# Altium schematic sheet DAC_Magneto.SchDoc: DAC
size 420 x 297 mm; Author: G.Kasprowicz; CompanyName: WUT ISE; DrawnBy: G.Kasprowicz; Organization: WUT ISE; Address1: PW ISE; Address2: Nowowiejska 15/19 00-665 Warsaw; Address3: gkasprow@gmail.com; DocumentNumber: 6; Revision: 2; SheetNumber: 6; SheetTotal: 7; ModifiedBy: -; CheckedDate: -; Title2: & reference; DivGrp: WUT ISE; Designer: G.Kasprowicz; ModifiedDate: -; ProjectName: Sensor Box
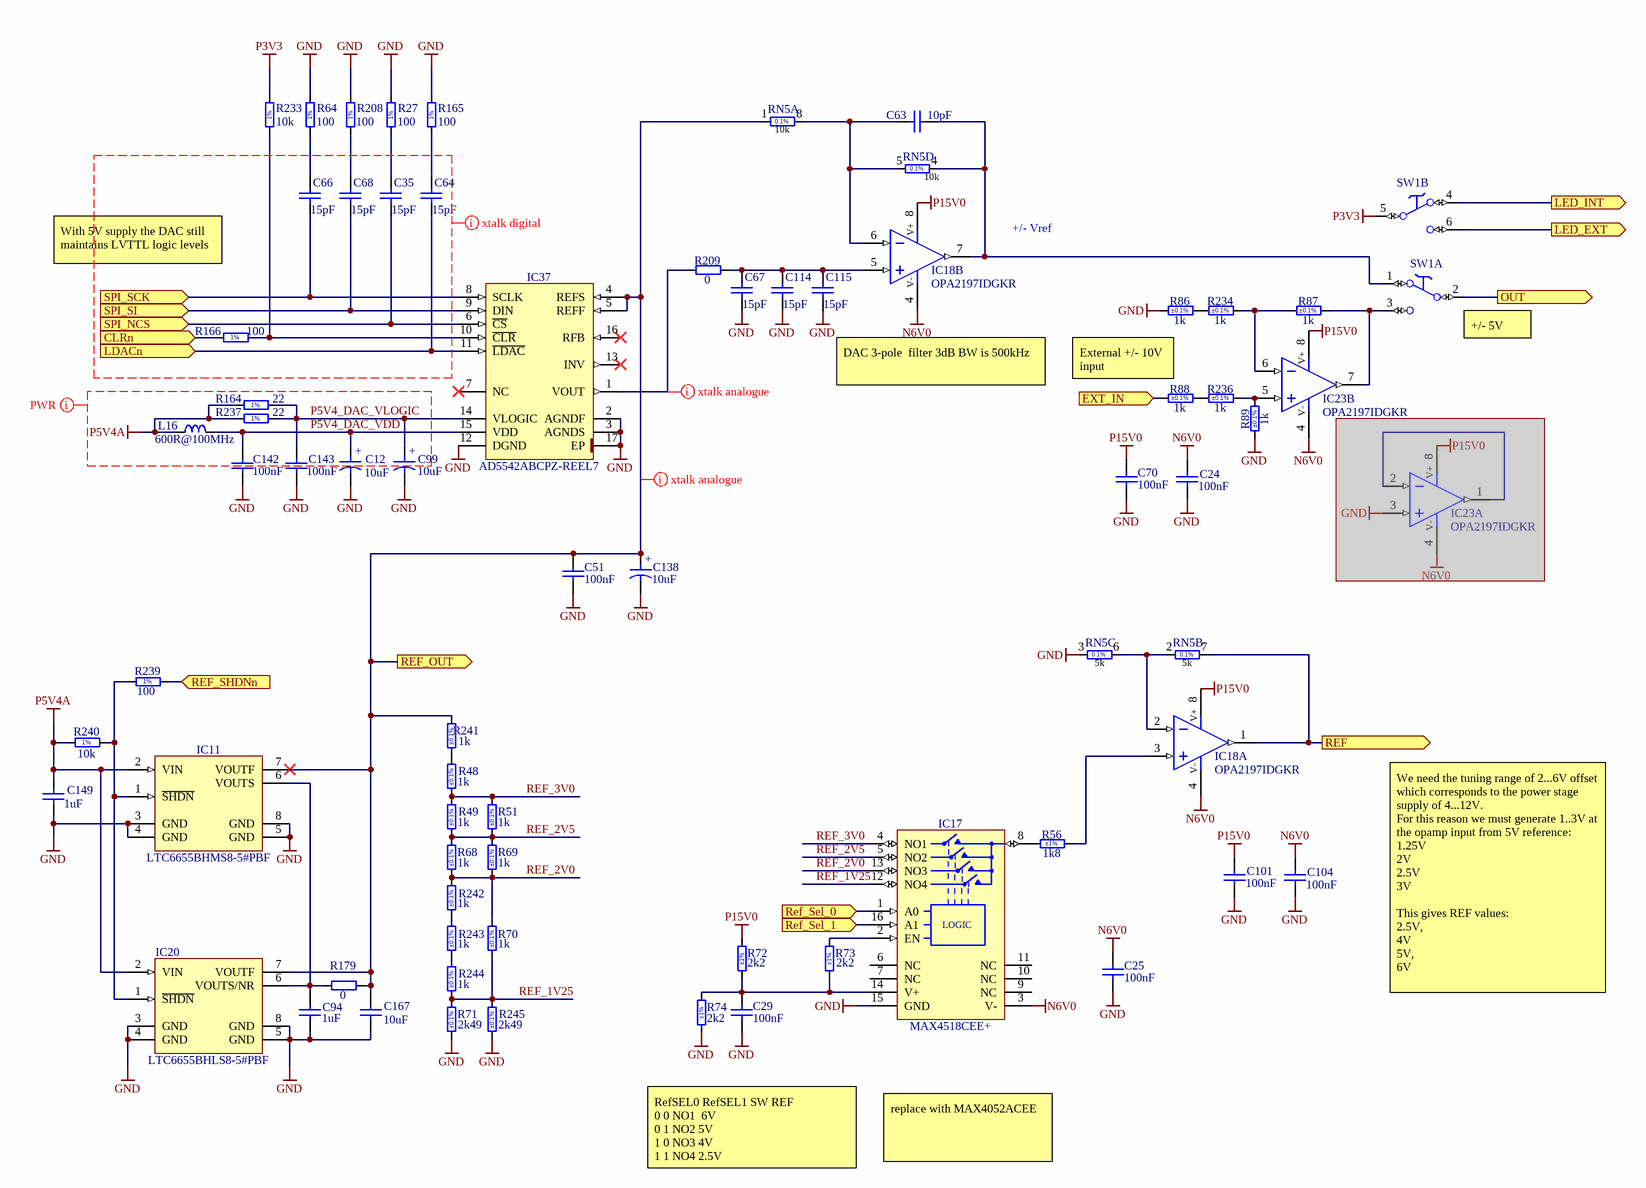
[diagram p0: DAC_Magneto.SchDoc]

## Parts
C12  10uF  [CAPMP3216X180N]
C24  100nF  [CAPC1005X55N]
C25  100nF  [CAPC1005X55N]
C29  100nF  [CAPC1005X55N]
C35  15pF  [CAPC1608X87N]
C51  100nF  [CAPC1005X55N]
C63  10pF  [CAPC1005X55N]
C64  15pF  [CAPC1608X87N]
C66  15pF  [CAPC1608X87N]
C67  15pF  [CAPC1608X87N]
C68  15pF  [CAPC1608X87N]
C70  100nF  [CAPC1005X55N]
C94  1uF  [CAPC1608X87N]
C99  10uF  [CAPMP3216X180N]
C101  100nF  [CAPC1005X55N]
C104  100nF  [CAPC1005X55N]
C114  15pF  [CAPC1608X87N]
C115  15pF  [CAPC1608X87N]
C138  10uF  [CAPMP3216X180N]
C142  100nF  [CAPC1005X55N]
C143  100nF  [CAPC1005X55N]
C149  1uF  [CAPC1608X87N]
C167  10uF  [CAPC1608X80N]
IC11  LTC6655BHMS8-5#PBF  [SOP65P490X110-8N]
IC17  MAX4518CEE+  [SOP63P600X175-16N]
IC18  OPA2197IDGKR  [SOP65P490X110-8N]  (parts A,B of 2)
IC20  LTC6655BHLS8-5#PBF  [8-CLCC]
IC23  OPA2197IDGKR  [SOP65P490X110-8N]  (parts A,B of 2)  (masked out: inside a compile mask, not in the netlist)
IC37  AD5542ABCPZ-REEL7  [QFN50P300X300X80-17N-S175]
L16  600R@100MHz  [INDC1005X55N]
R27  100  [RESC1005X40N]
R48  1k  Tolerance: ±0.1%  [RESC1608X55N]
R49  1k  Tolerance: ±0.1%  [RESC1608X55N]
R51  1k  Tolerance: ±0.1%  [RESC1608X55N]
R56  1k8  Tolerance: ±1%  [RESC1005X40N]
R64  100  [RESC1005X40N]
R68  1k  Tolerance: ±0.1%  [RESC1608X55N]
R69  1k  Tolerance: ±0.1%  [RESC1608X55N]
R70  1k  Tolerance: ±0.1%  [RESC1608X55N]
R71  2k49  Tolerance: ±0.1%  [RESC1608X55N]
R72  2k2  Tolerance: ±1%  [RESC1608X55N]
R73  2k2  Tolerance: ±1%  [RESC1608X55N]
R74  2k2  Tolerance: ±1%  [RESC1608X55N]
R86  1k  Tolerance: ±0.1%  [RESC1608X55N]
R87  1k  Tolerance: ±0.1%  [RESC1608X55N]
R88  1k  Tolerance: ±0.1%  [RESC1608X55N]
R89  1k  Tolerance: ±0.1%  [RESC1608X55N]
R164  22  [RESC1005X40N]
R165  100  [RESC1005X40N]
R166  100  [RESC1005X40N]
R179  0  [RESC1005X40N]
R208  100  [RESC1005X40N]
R209  0  [RESC1005X40N]
R233  10k  [RESC1005X40N]
R234  1k  Tolerance: ±0.1%  [RESC1608X55N]
R236  1k  Tolerance: ±0.1%  [RESC1608X55N]
R237  22  [RESC1005X40N]
R239  100  [RESC1005X40N]
R240  10k  [RESC1005X40N]
R241  1k  Tolerance: ±0.1%  [RESC1608X55N]
R242  1k  Tolerance: ±0.1%  [RESC1608X55N]
R243  1k  Tolerance: ±0.1%  [RESC1608X55N]
R244  1k  Tolerance: ±0.1%  [RESC1608X55N]
R245  2k49  Tolerance: ±0.1%  [RESC1608X55N]
RN5  10k 5K 5K 10K  [SOIC127P600X175-8N]  (value not drawn)  (parts A,B,C,D of 4)
SW1  Switch  [SW_C&K_JS202011CQN]  (value not drawn)  (parts A,B of 2)

## Ports
CLRn (in), EXT_IN (in), LDACn (in), LED_EXT (out), LED_INT (out), OUT (out), REF (out), REF_OUT (out), Ref_Sel_0 (in), Ref_Sel_1 (in), REF_SHDNn (in), SPI_NCS (in), SPI_SCK (in), SPI_SI (in)

## Nets
GND: C12.2 C24.1 C25.1 C29.1 C51.1 C67.1 C70.1 C94.1 C99.2 C101.1 C104.1 C114.1 C115.1 C138.2 C142.1 C143.1 C149.1 C167.1 IC11.3(GND) IC11.4(GND) IC11.5(GND) IC11.8(GND) IC17.15(GND) IC20.3(GND) IC20.4(GND) IC20.5(GND) IC20.8(GND) IC37.2(AGNDF) IC37.3(AGNDS) IC37.12(DGND) IC37.17(EP) R27.2 R64.2 R71.1 R74.1 R86.1 R89.1 R165.2 R208.2 R245.1 RN5.3
N6V0: C24.2 C25.2 C104.2 IC17.3(V-) IC18.4(V-) IC23.4(V-)
P3V3: R233.2 SW1.5(C)
P5V4A: C149.2 IC11.2(VIN) IC20.2(VIN) L16.1 R164.1 R237.1 R240.1
P15V0: C70.2 C101.2 IC18.8(V+) IC23.8(V+) R72.2
CLRn: R166.1 ; port CLRn
EXT_IN: R88.1 ; port EXT_IN
LDACn: C64.1 IC37.11(~{LDAC}) ; port LDACn
LED_EXT: SW1.6(NO) ; port LED_EXT
LED_INT: SW1.4(NC) ; port LED_INT
OUT: SW1.2(C) ; port OUT
P5V4_DAC_VDD: C12.1 C142.2 IC37.15(VDD) L16.2
P5V4_DAC_VLOGIC: C99.1 C143.2 IC37.14(VLOGIC) R164.2 R237.2
REF: IC18.1(OUT) RN5.7 ; port REF
REF_1V25: IC17.12(NO4) R70.1 R71.2 R244.1 R245.2
REF_2V0: IC17.13(NO3) R68.1 R69.1 R70.2 R242.2
REF_2V5: IC17.5(NO2) R49.1 R51.1 R68.2 R69.2
REF_3V0: IC17.4(NO1) R48.1 R49.2 R51.2
REF_OUT: C51.2 C138.1 C167.2 IC11.7(VOUTF) IC20.7(VOUTF) IC37.4(REFS) IC37.5(REFF) R179.2 R241.2 RN5.1 ; port REF_OUT
Ref_Sel_0: IC17.1(A0) ; port Ref_Sel_0
Ref_Sel_1: IC17.16(A1) ; port Ref_Sel_1
REF_SHDNn: R239.2 ; port REF_SHDNn
SPI_NCS: C35.1 IC37.6(~{CS}) ; port SPI_NCS
SPI_SCK: C66.1 IC37.8(SCLK) ; port SPI_SCK
SPI_SI: C68.1 IC37.9(DIN) ; port SPI_SI
NetC29_2: C29.2 IC17.14(V+) R72.1 R73.1 R74.2
NetC35_2: C35.2 R27.1
NetC63_1: C63.1 IC18.6(IN-) RN5.5 RN5.8
NetC63_2: C63.2 IC18.7(OUT) RN5.4 SW1.1(NC)
NetC64_2: C64.2 R165.1
NetC66_2: C66.2 R64.1
NetC67_2: C67.2 C114.2 C115.2 IC18.5(IN+) R209.2
NetC68_2: C68.2 R208.1
NetC94_2: C94.2 IC11.6(VOUTS) IC20.6(VOUTS/NR) R179.1
NetIC11_1: IC11.1(~{SHDN}) IC20.1(~{SHDN}) R239.1 R240.2
NetIC17_2: IC17.2(EN) R73.2
NetIC17_8: IC17.8(COM) R56.1
NetIC18_2: IC18.2(IN-) RN5.2 RN5.6
NetIC18_3: IC18.3(IN+) R56.2
NetIC23_5: IC23.5(IN+) R89.2 R236.2
NetIC23_6: IC23.6(IN-) R87.1 R234.2
NetIC23_7: IC23.7(OUT) R87.2 SW1.3(NO)
NetIC37_1: IC37.1(VOUT) R209.1
NetIC37_10: IC37.10(~{CLR}) R166.2 R233.1
NetR48_2: R48.2 R241.1
NetR86_2: R86.2 R234.1
NetR88_2: R88.2 R236.1
NetR242_1: R242.1 R243.2
NetR243_1: R243.1 R244.2

Not connected (* = marked no-connect by the designer): IC17 6(NC) 7(NC) 9(NC) 10(NC) 11(NC); IC37 7(NC)* 13(INV)* 16(RFB)*

## Layout directives
net class xtalk digital: (no net found under the mark)
net class xtalk analogue: NetIC37_1, REF_OUT
net class PWR: P5V4_DAC_VDD, P5V4_DAC_VLOGIC, P5V4A

## Notes on the sheet
- With 5V supply the DAC still maintains LVTTL logic levels
- +/- Vref
- (near SW1) +/- 5V
- DAC 3-pole  filter 3dB BW is 500kHz
- External +/- 10V input
- We need the tuning range of 2...6V offset
  which corresponds to the power stage supply of 4...12V.
  For this reason we must generate 1..3V at the opamp input from 5V reference:
  1.25V
  2V
  2.5V
  3V
  This gives REF values:
  2.5V,
  4V
  5V,
  6V
- RefSEL0	RefSEL1	SW	REF
  0	0	NO1 	6V
  0	1	NO2	5V
  1	0	NO3	4V
  1	1	NO4	2.5V
- replace with MAX4052ACEE
- Project/Equipment
- Document
- Designer
- Drawn by
- Check.by
- Copyright WUT ISE 2020.
  This documentation describes Open Hardware and is licensed under the CERN OHL v.1.2. You may redistribute and modify this documentation under the terms of the CERN OHL v.1.2. (http://ohwr.org/CERNOHL). This documentation is distributed WITHOUT ANY EXPRESS OR IMPLIED WARRANTY, INCLUDING OF MERCHANTABILITY, SATISFACTORY QUALITY AND FITNESS FOR A PARTICULAR PURPOSE. Please see the CERN OHL v.1.2 for applicable conditions.
- Contact
- File
- Last Mod.
- Print Date
- Sheet
- Size
- A3
- of
- Rev
- (in symbol CTE3216-18_10UF_16V_20%_AVX_TCJ) +
- (in symbol MAX4518CEE+) LOGIC
- (in symbol R0402_10K_1%_0.0625W_100PPM) 1%
- (in symbol R0402_22R_1%_0.0625W_100PPM) 1%
- (in symbol R0402_100R_1%_0.0625W_100PPM) 1%
- (in symbol RN_10K_5K_VISHAY_AORN2-1AT3, part A) 10k
- (in symbol RN_10K_5K_VISHAY_AORN2-1AT3, part B) 5k
- (in symbol RN_10K_5K_VISHAY_AORN2-1AT3, part C) 5k
- (in symbol RN_10K_5K_VISHAY_AORN2-1AT3, part D) 10k

## Library data of the parts
C12 C99 C138 = CTE3216-18_10UF_16V_20%_AVX_TCJ: Polarised capacitor; Part Description: ESR 0R200 Tantalum Solid Electrolytic Chip Capacitor with Conductive Polymer Electrode; Manufacturer: AVX; Manufacturer Part Number: TCJA106M016R0200 or  or TR3A106K016C1700; Manufacturer1 Part Number: TCJA106M016R0200; Voltage: 16V; Tolerance: ±20%; Part Number: CTE3216-18_10UF_16V_20%_AVX_TCJ; Component Kind: Standard; Component Type: Standard; Pin Count: 2; Value: 10uF; Status: Preferred; Case: A; Mounted: Yes; Socket: No; SMD: Yes; Sense: No; ComponentHeight: 1.8mm; HelpURL: \\cern.ch\dfs\Applications\Altium\Datasheets\CTE_AVX_TCJ.pdf; Author: CERN DEM JLC; CreateDate: 29.03.2012; LatestRevisionDate: 29.03.2012
C24 C25 C29 C51 C70 C101 C104 C142 C143 = CC0402_100NF_16V_10%_X5R: Non-polarised capacitor; Part Description: SMD Multilayer Chip Ceramic Capacitor; Manufacturer: GENERIC; Manufacturer1 Part Number: GRM155R61C104KA88D; Voltage: 16V; TC: X5R; Tolerance: ±10%; Part Number: CC0402_100NF_16V_10%_X5R; Component Kind: Standard; Component Type: Standard; Pin Count: 2; Value: 100nF; Status: None; Manufacturer Part Number: CC0402_100NF_16V_10%_X5R; Case: 0402; Mounted: Yes; Socket: No; SMD: Yes; Sense: No; Manufacturer1 Example: MURATA; Manufacturer1 ComponentHeight: 0.55mm; HelpURL: \\cern.ch\dfs\Applications\Altium\Datasheets\CC0402_X5R_MURATA_GRM.pdf; Author: CERN DEM JLC; CreateDate: 10.12.2013; LatestRevisionDate: 10.12.2013
C35 C64 C66-C68 C114 C115 = CC0603_15PF_50V_5%_NP0: Non-polarised capacitor; Part Description: SMD Multilayer Chip Ceramic Capacitor; Manufacturer: GENERIC; Manufacturer1 Part Number: CL10C150JB8NNND; Voltage: 50V; TC: C0G/NP0; Tolerance: ±5%; Part Number: CC0603_15PF_50V_5%_NP0; Component Kind: Standard; Component Type: Standard; Pin Count: 2; Value: 15pF; Status: Preferred; Manufacturer Part Number: CC0603_15PF_50V_5%_NP0; Case: 0603; Mounted: Yes; Socket: No; SMD: Yes; Sense: No; Manufacturer1 Example: PHYCOMP; Manufacturer1 ComponentHeight: 0.87mm; HelpURL: \\cern.ch\dfs\Applications\Altium\Datasheets\CC0603_NP0_PHYCOMP.pdf; Author: CERN DEM JLC; CreateDate: 03/12/2007; LatestRevisionDate: 03/12/2007
C63 = CC0402_10PF_50V_5%_C0G: Non-polarised capacitor; Part Description: SMD Multilayer Chip Ceramic Capacitor; Manufacturer: GENERIC; Manufacturer1 Part Number: C0402C100J5GACTU; Voltage: 50V; TC: C0G/NP0; Tolerance: ±5%; Part Number: CC0402_10PF_50V_5%_C0G; Component Kind: Standard; Component Type: Standard; Pin Count: 2; Value: 10pF; Status: Preferred; Manufacturer Part Number: CC0402_10PF_50V_5%_C0G; Case: 0402; Mounted: Yes; Socket: No; SMD: Yes; Sense: No; Manufacturer1 Example: KEMET; Manufacturer1 ComponentHeight: 0.55mm; HelpURL: \\cern.ch\dfs\Applications\Altium\Datasheets\CC0805_C0G_KEMET_(Commercial Grade).pdf; Author: CERN DEM JLC; CreateDate: 03.12.2007; LatestRevisionDate: 22.04.2015
C94 C149 = CC0603_1UF_25V_10%_X7R: Non-polarised capacitor; Part Description: SMD Multilayer Chip Ceramic Capacitor; Manufacturer: GENERIC; Manufacturer1 Part Number: GCM188R71E105KA64D; Voltage: 25V; TC: X7R; Tolerance: ±10%; Part Number: CC0603_1UF_25V_10%_X7R; Component Kind: Standard; Component Type: Standard; Pin Count: 2; Value: 1uF; Status: None; Manufacturer Part Number: CC0603_1UF_25V_10%_X7R; Case: 0603; Mounted: Yes; Socket: No; SMD: Yes; Sense: No; Manufacturer1 Example: MURATA; Manufacturer1 ComponentHeight: 0.9mm; HelpURL: \\cern.ch\dfs\Applications\Altium\Datasheets\CC0603_X7R_MURATA.pdf; Author: CERN DEM JLC; CreateDate: 18.01.2011; LatestRevisionDate: 18.01.2011
C167 = CC0603_10UF_16V_20%_X5R: Non-polarised capacitor; Part Description: SMD Multilayer Chip Ceramic Capacitor; Manufacturer: GENERIC; Manufacturer1 Part Number: GRM188R61C106MA73D; Voltage: 16V; TC: X5R; Tolerance: ±20%; Part Number: CC0603_10UF_16V_20%_X5R; Component Kind: Standard; Component Type: Standard; Pin Count: 2; Value: 10uF; Status: None; Manufacturer Part Number: CC0603_10UF_16V_20%_X5R; Case: 0603; Mounted: Yes; Socket: No; SMD: Yes; Sense: No; Manufacturer1 Example: MURATA; Manufacturer1 ComponentHeight: 0.8mm; HelpURL: \\cern.ch\dfs\Applications\Altium\Datasheets\CC0603_X5R_MURATA_GRM.pdf; Author: CERN DEM MR; CreateDate: 02.03.2016; LatestRevisionDate: 02.03.2016
IC11 = LTC6655BHMS8-5#PBF: 0.25ppm Noise, Low Drift Precision Buffered Voltage Reference; Part Description: 5V, 0.25ppm Noise, Low Drift Precision Buffered Voltage Reference; Manufacturer1: LINEAR TECHNOLOGY; PressFit: No; Bonding: No; Part Number: LTC6655BHMS8-5#PBF; Component Kind: Standard; Component Type: Standard; Device: LTC6655BHMS8-5#PBF; PackageDescription: SOP, 8-Leads, Body 3.1x3.1mm (max), Pitch 0.65mm, IPC Medium Density; Manufacturer1 Part Number: LTC6655BHMS8-5#PBF; Pin Count: 8; Case: SSOP8; Mounted: Yes; Socket: No; SMD: Yes; Sense: No; ComponentHeight: 1.1mm; HelpURL: \\cern.ch\dfs\Applications\Altium\Datasheets\LTC6655BHMS8-5#PBF.pdf; Author: CERN DEM JLC; CreateDate: 07.06.2012; LatestRevisionDate: 07.06.2012
IC17 = MAX4518CEE+: Precision, 4-Channel Low-Voltage, CMOS Analog Multiplexer; Manufacturer1: MAXIM; PressFit: No; Bonding: No; Part Number: MAX4518CEE+; Component Kind: Standard; Component Type: Standard; Device: MAX4518CEE+; PackageDescription: SOP, 0.635mm Pitch; 16 Pin, 3.9mm W X 4.895mm L X 1.75mm H body, IPC Medium Density; Part Description: Precision, 4-Channel Low-Voltage, CMOS Analog Multiplexer; Manufacturer1 Part Number: MAX4518CEE+; Pin Count: 16; Case: SSOP16; Mounted: Yes; Socket: No; SMD: Yes; Sense: No; ComponentHeight: 1.75mm; Author: CERN DEM JLC; HelpURL: \\cern.ch\dfs\Applications\Altium\Datasheets\MAX4518CEE+.pdf; CreateDate: 10.11.2014; LatestRevisionDate: 04.04.2022
IC18 = OA_OPA2197IDGKR: 36-V, Precision, Rail-to-Rail Input Output, Low Offset Voltage Op Amp 8-VSSOP; Part Description: High-Precision, Low-Noise, Rail-to-Rail Output,10-MHz Op Amp; Manufacturer1: TEXAS INSTRUMENTS; PressFit: No; Bonding: No; Part Number: OPA2197IDGKR; Component Kind: Standard; Component Type: Standard; Device: OPA2197IDGKR; PackageDescription: SOP, 0.65mm pitch; 8 pin, 3.00mm W X 3.00mm L X 1.10mm H body, IPC Medium Density; Manufacturer1 Part Number: OPA2197IDGKR; Pin Count: 8; Case: MSOP8; Mounted: Yes; Socket: No; SMD: Yes; Sense: No; ComponentHeight: 1.1mm; Author: GK; HelpURL: \\cern.ch\dfs\Applications\Altium\Datasheets\OPA2140AIDGK.pdf; CreateDate: 20.04.2017; LatestRevisionDate: 20.04.2017
IC20 = REF_LTC6655CHLS8-4.096: 5.0V, 1uA Precision Voltage Reference; Part Description: 5.0V, 0.05%, 10ppm/°C, 1uA Precision Voltage Reference; Manufacturer1: LINEAR TECHNOLOGY; PressFit: No; Bonding: No; Part Number: LTC6655BHLS8-5#PBF; Component Kind: Standard; Component Type: Standard; Device: LTC6655BHLS8-5#PBF; Footprint: SOT95P280X100-6N; PackageDescription: LCC, 8-Pins, Body 5,00x5,00mmx1,45mm, Pitch 1,27mm, IPC Medium Density; Manufacturer1 Part Number: LTC6655BHLS8-5#PBF; Pin Count: 8; Case: 8-CLCC; Mounted: Yes; Socket: No; SMD: Yes; Sense: No; ComponentHeight: 1mm; HelpURL: \\cern.ch\dfs\Applications\Altium\Datasheets\LT6656ACS6-3.3#TRMPBF.pdf; Author: GK; CreateDate: 2011-10-10; LatestRevisionDate: 2011-10-10
IC23 = OA_OPA2197IDGKR: 36-V, Precision, Rail-to-Rail Input Output, Low Offset Voltage Op Amp 8-VSSOP; Part Description: High-Precision, Low-Noise, Rail-to-Rail Output,10-MHz Op Amp; Manufacturer: TEXAS INSTRUMENTS; PressFit: No; Bonding: No; Part Number: OPA2197IDGKR; Component Kind: Standard; Component Type: Standard; Device: OPA2197IDGKR; PackageDescription: SOP, 0.65mm pitch; 8 pin, 3.00mm W X 3.00mm L X 1.10mm H body, IPC Medium Density; Manufacturer Part Number: OPA2197IDGKR; Pin Count: 8; Case: MSOP8; Mounted: Yes; Socket: No; SMD: Yes; Sense: No; ComponentHeight: 1.1mm; Author: GK; HelpURL: \\cern.ch\dfs\Applications\Altium\Datasheets\OPA2140AIDGK.pdf; CreateDate: 20.04.2017; LatestRevisionDate: 20.04.2017
IC37 = AD5542ABCPZ-REEL7: 2.7V to 5.5V, Serial-Input, Voltage-Output, 16-Bit DAC; Manufacturer1: ANALOG DEVICES; PressFit: No; Bonding: No; Part Number: AD5542ABCPZ-REEL7; Component Kind: Standard; Component Type: Standard; Device: AD5542ABCPZ-REEL7; PackageDescription: QFN, 0.50mm Pitch, Square; 16 Pin, 3.00mm L X 3.00mm W X 0.80mm H Body (w/Thermal Tab 1.75 X 1.75mm),  IPC Medium Density; Part Description: 2.7V to 5.5V, Serial-Input, Voltage-Output, 16-Bit DAC; Manufacturer1 Part Number: AD5542ABCPZ-REEL7; Pin Count: 17; Case: QFN16; Mounted: Yes; Socket: No; SMD: Yes; Sense: No; ComponentHeight: 0.8mm; Author: CERN DEM JLC; HelpURL: \\cern.ch\dfs\Applications\Altium\Datasheets\AD5542ABCPZ-REEL7.pdf; CreateDate: 29.11.2018; LatestRevisionDate: 29.11.2018
L16 = IND0402_MURATA_BLM15HD601SN1: Inductor; Part Description: SMD EMIFIL Suppression Chip Ferrite Bead; Manufacturer1: MURATA; Manufacturer1 Part Number: BLM15HD601SN1D; Power: 300mA; Resistance: 0.85R; Tolerance: ±25%; Part Number: IND0402_MURATA_BLM15HD601SN1; Component Kind: Standard; Component Type: Standard; Pin Count: 2; Value: 600R@100MHz; Status: None; Case: 0402; Mounted: Yes; Socket: No; SMD: Yes; Sense: No; ComponentHeight: 0.55mm; HelpURL: \\cern.ch\dfs\Applications\Altium\Datasheets\IND0402_MURATA_BLM15H.pdf; Author: CERN DEM JLC; CreateDate: 28/02/2012; LatestRevisionDate: 28/02/2012
R27 R64 R165 R166 R208 R239 = R0402_100R_1%_0.0625W_100PPM: Resistor - 1%; Part Description: General Purpose Thick Film Chip Resistor; Manufacturer: GENERIC; Manufacturer1: Vishay; Manufacturer1 Part Number: RCA0402100RFKED; TC: ±100ppm/°C; PressFit: No; Part Number: R0402_100R_1%_0.0625W_100PPM; Component Kind: Standard; Component Type: Standard; Pin Count: 2; Value: 100; Status: Not Recommended; Power: 0.0625W; Tolerance: ±1%; Manufacturer Part Number: R0402_100R_1%_0.0625W_100PPM; Case: 0402; Mounted: Yes; Sense: No; Socket: No; SMD: Yes; Manufacturer1 ComponentHeight: 0.4mm; HelpURL: \\cern.ch\dfs\Applications\Altium\Datasheets\R0402_Phycomp_RC0402.pdf; Author: CERN DEM JLC; CreateDate: 03.12.2007; LatestRevisionDate: 17.10.2012
R48 R49 R51 R68-R70 R86-R89 R234 R236 R241-R244 = R0603_1K_0.1%_0.063W_10PPM: Resistor - 0.1%; Part Description: Thin Film Chip Resistor; Manufacturer: GENERIC; Manufacturer1: TYCO HOLSWORTHY; Manufacturer1 Part Number: RN73C1J1K0BTG; Power: 0.063W; TC: ±10ppm; PressFit: No; Part Number: R0603_1K_0.1%_0.063W_10PPM; Component Kind: Standard; Component Type: Standard; Pin Count: 2; Value: 1k; Status: Not Recommended; Manufacturer Part Number: R0603_1K_0.1%_0.063W_10PPM; Case: 0603; Mounted: Yes; Sense: No; Socket: No; SMD: Yes; Manufacturer1 ComponentHeight: 0.55mm; HelpURL: \\cern.ch\dfs\Applications\Altium\Datasheets\R0603_Tyco_RN73.pdf; Author: CERN DEM BC; CreateDate: 23.05.2016; LatestRevisionDate: 23.05.2016
R56 = R0402_1K8_1%_0.0625W_100PPM: Resistor - 1%; Part Description: General Purpose Thick Film Chip Resistor; Manufacturer: GENERIC; Manufacturer1: Vishay; Manufacturer1 Part Number: CRCW04021K80FKED; TC: ±100ppm/°C; PressFit: No; Part Number: R0402_1K8_1%_0.0625W_100PPM; Component Kind: Standard; Component Type: Standard; Pin Count: 2; Value: 1k8; Status: Not Recommended; Power: 0.0625W; Manufacturer Part Number: R0402_1K8_1%_0.0625W_100PPM; Case: 0402; Mounted: Yes; Sense: No; Socket: No; SMD: Yes; Manufacturer1 ComponentHeight: 0.4mm; HelpURL: \\cern.ch\dfs\Applications\Altium\Datasheets\R0402_Phycomp_RC0402.pdf; Author: CERN DEM JLC; CreateDate: 03.12.2007; LatestRevisionDate: 17.10.2012
R71 R245 = R0603_2K49_0.1%_0.063W_10PPM: Resistor - 0.1%; Part Description: Thin Film Chip Resistor; Manufacturer: GENERIC; Manufacturer1: TYCO HOLSWORTHY; Manufacturer1 Part Number: RN73C1J2K49BTDF; Power: 0.063W; TC: ±10ppm; PressFit: No; Part Number: R0603_2K49_0.1%_0.063W_10PPM; Component Kind: Standard; Component Type: Standard; Pin Count: 2; Value: 2k49; Status: Not Recommended; Manufacturer Part Number: R0603_2K49_0.1%_0.063W_10PPM; Case: 0603; Mounted: Yes; Sense: No; Socket: No; SMD: Yes; Manufacturer1 ComponentHeight: 0.5mm; HelpURL: \\cern.ch\dfs\Applications\Altium\Datasheets\R0603_Tyco_RN73.pdf; Author: CERN DEM JLC; CreateDate: 03.12.2007; LatestRevisionDate: 13.03.2008
R72-R74 = R0603_2K2_1%_0.1W_100PPM: Resistor - 1%; Part Description: General Purpose Thick Film Chip Resistor; Manufacturer: GENERIC; Manufacturer1: Vishay; Manufacturer1 Part Number: CRCW06032K20FKEA; Power: 0.1W; TC: ±100ppm/°C; PressFit: No; Part Number: R0603_2K2_1%_0.1W_100PPM; Component Kind: Standard; Component Type: Standard; Pin Count: 2; Value: 2k2; Status: Preferred; Manufacturer Part Number: R0603_2K2_1%_0.1W_100PPM; Case: 0603; Mounted: Yes; Sense: No; Socket: No; SMD: Yes; Manufacturer1 ComponentHeight: 0.55mm; HelpURL: \\cern.ch\dfs\Applications\Altium\Datasheets\R0603_NIC_NRC.pdf; Author: CERN DEM JLC; CreateDate: 03.12.2007; LatestRevisionDate: 13.03.2008
R164 R237 = R0402_22R_1%_0.0625W_100PPM: Resistor - 1%; Part Description: General Purpose Thick Film Chip Resistor; Manufacturer: GENERIC; Manufacturer1: Vishay; Manufacturer1 Part Number: CRCW040222R0FKEDC; TC: ±100ppm/°C; PressFit: No; Part Number: R0402_22R_1%_0.0625W_100PPM; Component Kind: Standard; Component Type: Standard; Pin Count: 2; Value: 22; Status: Not Recommended; Power: 0.0625W; Tolerance: ±1%; Manufacturer Part Number: R0402_22R_1%_0.0625W_100PPM; Case: 0402; Mounted: Yes; Socket: No; SMD: Yes; Manufacturer1 ComponentHeight: 0.4mm; HelpURL: \\cern.ch\dfs\Applications\Altium\Datasheets\R0402_Phycomp_RC0402.pdf; Author: CERN DEM JLC; CreateDate: 03.12.2007; LatestRevisionDate: 17.10.2012; Sense: No
R179 = R0402_0R_JUMPER: Resistor; Part Description: 1A (0.05R Max DC Resistance) Zero Ohm Jumper; Manufacturer: GENERIC; Manufacturer1: Vishay; Manufacturer1 Part Number: CRCW04020000Z0EDC; Part Number: R0402_0R_JUMPER; Component Kind: Standard; Component Type: Standard; Pin Count: 2; Value: 0; Status: Not recommended; Manufacturer Part Number: R0402_0R_JUMPER; Case: 0402; Mounted: Yes; Sense: No; Socket: No; SMD: Yes; Manufacturer1 ComponentHeight: 0.4mm; HelpURL: \\cern.ch\dfs\Applications\Altium\Datasheets\R0402_Phycomp_RC0402.pdf; Author: CERN DEM JLC; CreateDate: 03.12.2007; LatestRevisionDate: 17.10.2012
R209 = R0402_0R_JUMPER: Resistor; Part Description: 1A (0.05R Max DC Resistance) Zero Ohm Jumper; Manufacturer: GENERIC; Manufacturer1: Vishay; Manufacturer1 Part Number: CRCW04020000Z0EDC; PressFit: No; Part Number: R0402_0R_JUMPER; Component Kind: Standard; Component Type: Standard; Pin Count: 2; Value: 0; Status: Not Recommended; Manufacturer Part Number: R0402_0R_JUMPER; Case: 0402; Mounted: Yes; Sense: No; Socket: No; SMD: Yes; Manufacturer1 ComponentHeight: 0.4mm; HelpURL: \\cern.ch\dfs\Applications\Altium\Datasheets\R0402_Phycomp_RC0402.pdf; Author: CERN DEM JLC; CreateDate: 03.12.2007; LatestRevisionDate: 17.10.2012
R233 R240 = R0402_10K_1%_0.0625W_100PPM: Resistor - 1%; Part Description: General Purpose Thick Film Chip Resistor; Manufacturer: GENERIC; Manufacturer1: Vishay; Manufacturer1 Part Number: RCA040210K0FKED; TC: ±100ppm/°C; PressFit: No; Part Number: R0402_10K_1%_0.0625W_100PPM; Component Kind: Standard; Component Type: Standard; Pin Count: 2; Value: 10k; Status: Not Recommended; Power: 0.0625W; Tolerance: ±1%; Manufacturer Part Number: R0402_10K_1%_0.0625W_100PPM; Case: 0402; Mounted: Yes; Sense: No; Socket: No; SMD: Yes; Manufacturer1 ComponentHeight: 0.4mm; HelpURL: \\cern.ch\dfs\Applications\Altium\Datasheets\R0402_Phycomp_RC0402.pdf; Author: CERN DEM JLC; CreateDate: 03.12.2007; LatestRevisionDate: 17.10.2012
RN5 = RN_10K_5K_VISHAY_AORN2-1AT3: DIL8 Resistor Network 4 Resistors 10k-5k-5k-10k 0.1%; Part Description: Dual-In-Line Thin Film Precision Automotive Resistors Network, (4 Isolated) - AORN Series; Manufacturer1: VISHAY DALE; Manufacturer1 Part Number: AORN2-1AT5; Power: 4x0.1W; TC: ±25ppm/°C; PressFit: No; Part Number: RN_10K_5K_VISHAY_AORN2-1AT3; Component Kind: Standard; Component Type: Standard; Pin Count: 8; Value: 10k 5K 5K 10K; Sense: No; Tolerance: 0.1%; Case: SOIC8; Mounted: Yes; Socket: No; SMD: Yes; ComponentHeight: 1.73mm; HelpURL: \\cern.ch\dfs\Applications\Altium\Datasheets\RN_VISHAY_AORN.pdf; Author: CERN DEM JLC; CreateDate: 20.02.2017; LatestRevisionDate: 20.02.2017
SW1 = SW_C&K_JS202011CQN: DPDTSwitch; Part Description: DPDT Vertical Slide Subminiature Switch, Thru-Hole Mount, Contact Rating 300mA 6VDC, JS Series; Manufacturer1: C&K; PressFit: No; Part Number: SW_C&K_JS202011CQN; Component Kind: Standard; Component Type: Standard; Pin Count: 6; PackageDescription: Body 9x3.6mm, DPDT Vertical Slide Subminiature Switch, Thru-Hole Mount, JS Series; Family: Switch; Mounted: Yes; Socket: No; SMD: No; Sense: No; Status: None; Manufacturer1 Part Number: JS202011CQN; ComponentHeight: 3.5mm; HelpURL: \\cern.ch\dfs\Applications\Altium\Datasheets\SW_C&K_JS202011CQN.pdf; Author: CERN DEM MR; CreateDate: 13.11.2019; LatestRevisionDate: 13.11.2019